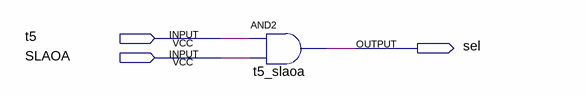
[diagram p0: schematic sheet]
// Quartus schematic sel.bdf as structural Verilog: 1 symbols, 3 pins
module sel (
  input  t5,
  input  SLAOA,
  output sel
);

  and t5_slaoa (sel, t5, SLAOA);
endmodule
